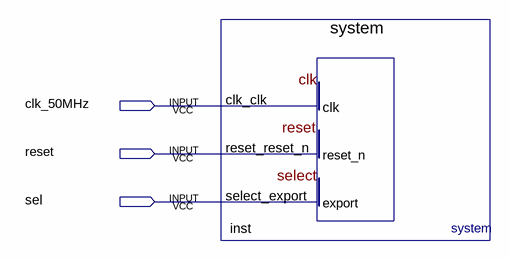
[diagram p0: schematic sheet]
// Quartus schematic mp_fifo_system.bdf as structural Verilog: 1 symbols, 3 pins
module mp_fifo_system (
  input  clk_50MHz,
  input  reset,
  input  sel
);

  system inst (.clk_clk(clk_50MHz), .reset_reset_n(reset), .select_export(sel));
endmodule
